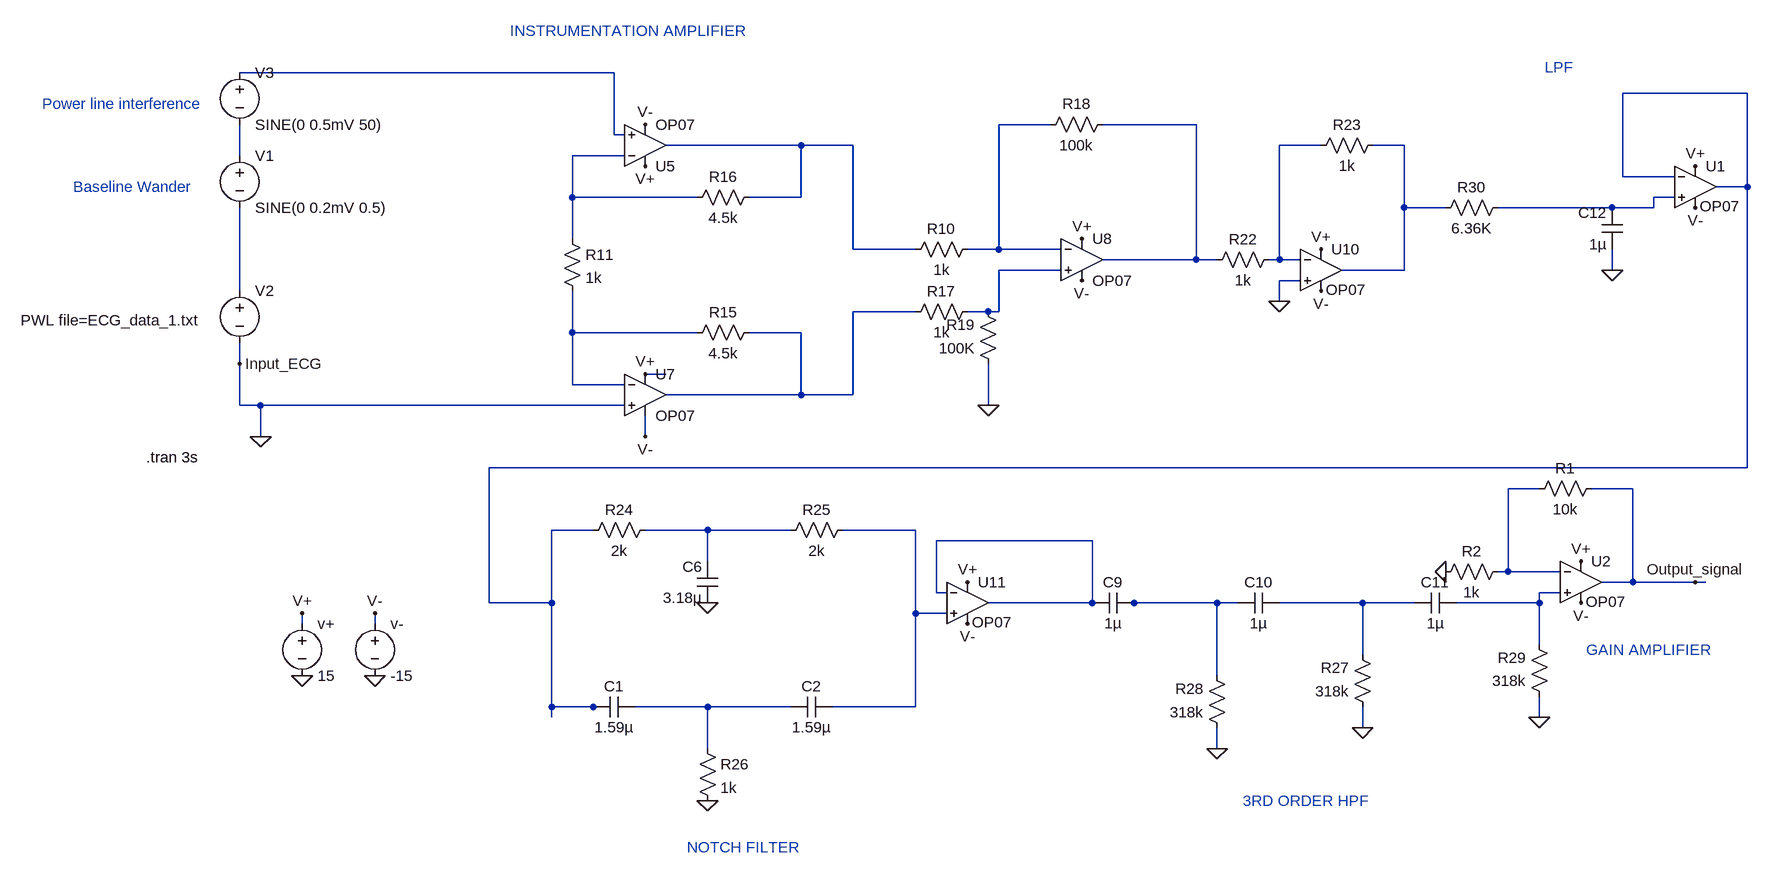
[diagram p0: schematic ECG_sim_Circuit.asc]
ECG_sim_Circuit.asc, the LTspice schematic file:
Version 4.1
SHEET 1 4292 2344
WIRE 336 736 -240 736
WIRE 2080 768 1888 768
WIRE 1008 816 928 816
WIRE 1232 816 1088 816
WIRE 336 832 336 736
WIRE 352 832 336 832
WIRE 624 848 416 848
WIRE 704 848 624 848
WIRE 1424 848 1360 848
WIRE 1552 848 1504 848
WIRE -240 864 -240 816
WIRE 352 864 272 864
WIRE 1888 896 1888 768
WIRE 1968 896 1888 896
WIRE 2080 912 2080 768
WIRE 2080 912 2032 912
WIRE 272 928 272 864
WIRE 464 928 272 928
WIRE 624 928 624 848
WIRE 624 928 544 928
WIRE 1968 928 1936 928
WIRE 1552 944 1552 848
WIRE 1616 944 1552 944
WIRE 1872 944 1696 944
WIRE 1936 944 1936 928
WIRE 1936 944 1872 944
WIRE 272 992 272 928
WIRE 704 1008 704 848
WIRE 800 1008 704 1008
WIRE 928 1008 928 816
WIRE 928 1008 880 1008
WIRE 1024 1008 928 1008
WIRE 1232 1024 1232 816
WIRE 1232 1024 1088 1024
WIRE 1264 1024 1232 1024
WIRE 1360 1024 1360 848
WIRE 1360 1024 1344 1024
WIRE 1392 1024 1360 1024
WIRE 1024 1040 928 1040
WIRE 1552 1040 1552 944
WIRE 1552 1040 1456 1040
WIRE 1872 1040 1872 1008
WIRE 1392 1056 1360 1056
WIRE -240 1072 -240 944
WIRE 1360 1088 1360 1056
WIRE 800 1104 704 1104
WIRE 912 1104 880 1104
WIRE 928 1104 928 1040
WIRE 928 1104 912 1104
WIRE 272 1136 272 1072
WIRE 464 1136 272 1136
WIRE 624 1136 544 1136
WIRE -240 1184 -240 1152
WIRE 416 1200 384 1200
WIRE 272 1216 272 1136
WIRE 352 1216 272 1216
WIRE 624 1232 624 1136
WIRE 624 1232 416 1232
WIRE 704 1232 704 1104
WIRE 704 1232 624 1232
WIRE -240 1248 -240 1184
WIRE -208 1248 -240 1248
WIRE 352 1248 -208 1248
WIRE 912 1248 912 1184
WIRE -208 1296 -208 1248
WIRE 384 1296 384 1264
WIRE 2080 1344 2080 912
WIRE 2080 1344 144 1344
WIRE 1760 1376 1712 1376
WIRE 1904 1376 1840 1376
WIRE 304 1440 240 1440
WIRE 480 1440 384 1440
WIRE 608 1440 480 1440
WIRE 800 1440 688 1440
WIRE 1072 1456 832 1456
WIRE 480 1488 480 1440
WIRE 1712 1504 1712 1376
WIRE 1712 1504 1696 1504
WIRE 1792 1504 1712 1504
WIRE 1904 1520 1904 1376
WIRE 1904 1520 1856 1520
WIRE 2000 1520 1904 1520
WIRE 2016 1520 2000 1520
WIRE 832 1536 832 1456
WIRE 848 1536 832 1536
WIRE 1792 1536 1760 1536
WIRE 144 1552 144 1344
WIRE 240 1552 240 1440
WIRE 240 1552 144 1552
WIRE 1072 1552 1072 1456
WIRE 1072 1552 912 1552
WIRE 1088 1552 1072 1552
WIRE 1136 1552 1120 1552
WIRE 1264 1552 1136 1552
WIRE 1296 1552 1264 1552
WIRE 1488 1552 1360 1552
WIRE 1568 1552 1488 1552
WIRE 1760 1552 1760 1536
WIRE 1760 1552 1632 1552
WIRE 800 1568 800 1440
WIRE 848 1568 800 1568
WIRE -144 1584 -144 1568
WIRE -32 1584 -32 1568
WIRE 1760 1616 1760 1552
WIRE 1488 1632 1488 1552
WIRE 1264 1664 1264 1552
WIRE 240 1712 240 1552
WIRE 304 1712 240 1712
WIRE 320 1712 304 1712
WIRE 480 1712 368 1712
WIRE 608 1712 480 1712
WIRE 800 1712 800 1568
WIRE 800 1712 672 1712
WIRE 240 1728 240 1712
WIRE 1760 1728 1760 1696
WIRE 1488 1744 1488 1712
WIRE 480 1776 480 1712
WIRE 1264 1776 1264 1744
FLAG -144 1664 0
FLAG -32 1664 0
FLAG -144 1568 V+
FLAG -32 1568 V-
FLAG 912 1248 0
FLAG -208 1296 0
FLAG 384 880 V+
FLAG 384 1200 V+
FLAG 384 1296 V-
FLAG 384 816 V-
FLAG 1056 1056 V-
FLAG 1056 992 V+
FLAG 1360 1088 0
FLAG 1424 1008 V+
FLAG 1424 1072 V-
FLAG 480 1552 0
FLAG 480 1856 0
FLAG 880 1520 V+
FLAG 880 1584 V-
FLAG 1264 1776 0
FLAG 1488 1744 0
FLAG 1760 1728 0
FLAG 1872 1040 0
FLAG 2000 880 V+
FLAG 2000 944 V-
FLAG 1824 1488 V+
FLAG 1824 1552 V-
FLAG 1616 1504 0
FLAG -240 1184 Input_ECG
FLAG 2000 1520 Output_signal
DATAFLAG -240 1024 ""
SYMBOL voltage -144 1568 R0
SYMATTR InstName v+
SYMATTR Value 15
SYMBOL voltage -32 1568 R0
WINDOW 123 0 0 Left 0
WINDOW 39 0 0 Left 0
SYMATTR InstName v-
SYMATTR Value -15
SYMBOL OpAmps\\OP07 384 912 M180
SYMATTR InstName U5
SYMBOL OpAmps\\OP07 384 1168 R0
SYMATTR InstName U7
SYMBOL OpAmps\\OP07 1056 960 R0
SYMATTR InstName U8
SYMBOL res 896 992 R90
WINDOW 0 0 56 VBottom 2
WINDOW 3 32 56 VTop 2
SYMATTR InstName R10
SYMATTR Value 1k
SYMBOL res 256 976 R0
SYMATTR InstName R11
SYMATTR Value 1k
SYMBOL res 560 1120 R90
WINDOW 0 0 56 VBottom 2
WINDOW 3 32 56 VTop 2
SYMATTR InstName R15
SYMATTR Value 4.5k
SYMBOL res 560 912 R90
WINDOW 0 0 56 VBottom 2
WINDOW 3 32 56 VTop 2
SYMATTR InstName R16
SYMATTR Value 4.5k
SYMBOL res 896 1088 R90
WINDOW 0 0 56 VBottom 2
WINDOW 3 32 56 VTop 2
SYMATTR InstName R17
SYMATTR Value 1k
SYMBOL res 1104 800 R90
WINDOW 0 0 56 VBottom 2
WINDOW 3 32 56 VTop 2
SYMATTR InstName R18
SYMATTR Value 100k
SYMBOL res 928 1200 R180
WINDOW 0 36 76 Left 2
WINDOW 3 36 40 Left 2
SYMATTR InstName R19
SYMATTR Value 100K
SYMBOL voltage -240 1056 R0
WINDOW 3 -337 61 Left 2
WINDOW 123 0 0 Left 0
WINDOW 39 0 0 Left 0
SYMATTR Value PWL file=ECG_data_1.txt
SYMATTR InstName V2
SYMBOL OpAmps\\OP07 1424 976 R0
WINDOW 3 7 94 Left 2
SYMATTR InstName U10
SYMBOL res 1360 1008 R90
WINDOW 0 0 56 VBottom 2
WINDOW 3 32 56 VTop 2
SYMATTR InstName R22
SYMATTR Value 1k
SYMBOL res 1520 832 R90
WINDOW 0 0 56 VBottom 2
WINDOW 3 32 56 VTop 2
SYMATTR InstName R23
SYMATTR Value 1k
SYMBOL cap 368 1696 R90
WINDOW 0 0 32 VBottom 2
WINDOW 3 32 32 VTop 2
SYMATTR InstName C1
SYMATTR Value 1.59µ
SYMBOL cap 672 1696 R90
WINDOW 0 0 32 VBottom 2
WINDOW 3 32 32 VTop 2
SYMATTR InstName C2
SYMATTR Value 1.59µ
SYMBOL cap 496 1552 R180
WINDOW 0 24 56 Left 2
WINDOW 3 24 8 Left 2
SYMATTR InstName C6
SYMATTR Value 3.18µ
SYMBOL res 400 1424 R90
WINDOW 0 0 56 VBottom 2
WINDOW 3 32 56 VTop 2
SYMATTR InstName R24
SYMATTR Value 2k
SYMBOL res 704 1424 R90
WINDOW 0 0 56 VBottom 2
WINDOW 3 32 56 VTop 2
SYMATTR InstName R25
SYMATTR Value 2k
SYMBOL OpAmps\\OP07 880 1488 R0
WINDOW 3 7 94 Left 2
SYMATTR InstName U11
SYMBOL res 464 1760 R0
SYMATTR InstName R26
SYMATTR Value 1k
SYMBOL cap 1136 1536 R90
WINDOW 0 0 32 VBottom 2
WINDOW 3 32 32 VTop 2
SYMATTR InstName C9
SYMATTR Value 1µ
SYMBOL res 1280 1760 R180
WINDOW 0 36 76 Left 2
WINDOW 3 36 40 Left 2
SYMATTR InstName R28
SYMATTR Value 318k
SYMBOL res 1504 1728 R180
WINDOW 0 36 76 Left 2
WINDOW 3 36 40 Left 2
SYMATTR InstName R27
SYMATTR Value 318k
SYMBOL cap 1360 1536 R90
WINDOW 0 0 32 VBottom 2
WINDOW 3 32 32 VTop 2
SYMATTR InstName C10
SYMATTR Value 1µ
SYMBOL res 1776 1712 R180
WINDOW 0 36 76 Left 2
WINDOW 3 36 40 Left 2
SYMATTR InstName R29
SYMATTR Value 318k
SYMBOL cap 1632 1536 R90
WINDOW 0 0 32 VBottom 2
WINDOW 3 32 32 VTop 2
SYMATTR InstName C11
SYMATTR Value 1µ
SYMBOL res 1712 928 R90
WINDOW 0 0 56 VBottom 2
WINDOW 3 32 56 VTop 2
SYMATTR InstName R30
SYMATTR Value 6.36K
SYMBOL cap 1888 1008 R180
WINDOW 0 24 56 Left 2
WINDOW 3 24 8 Left 2
SYMATTR InstName C12
SYMATTR Value 1µ
SYMBOL OpAmps\\OP07 2000 848 R0
WINDOW 3 7 94 Left 2
SYMATTR InstName U1
SYMBOL OpAmps\\OP07 1824 1456 R0
WINDOW 3 7 94 Left 2
SYMATTR InstName U2
SYMBOL res 1856 1360 R90
WINDOW 0 0 56 VBottom 2
WINDOW 3 32 56 VTop 2
SYMATTR InstName R1
SYMATTR Value 10k
SYMBOL res 1712 1488 R90
WINDOW 0 0 56 VBottom 2
WINDOW 3 32 56 VTop 2
SYMATTR InstName R2
SYMATTR Value 1k
SYMBOL voltage -240 848 R0
WINDOW 123 0 0 Left 0
WINDOW 39 0 0 Left 0
SYMATTR InstName V1
SYMATTR Value SINE(0 0.2mV 0.5)
SYMBOL voltage -240 720 R0
WINDOW 123 0 0 Left 0
WINDOW 39 0 0 Left 0
SYMATTR InstName V3
SYMATTR Value SINE(0 0.5mV 50)
TEXT -384 1328 Left 2 !.tran 3s
TEXT -544 784 Left 2 ;Power line interference
TEXT -496 912 Left 2 ;Baseline Wander
TEXT 176 672 Left 2 ;INSTRUMENTATION AMPLIFIER
TEXT 1768 728 Left 2 ;LPF
TEXT 1304 1856 Left 2 ;3RD ORDER HPF
TEXT 448 1928 Left 2 ;NOTCH FILTER
TEXT 1832 1624 Left 2 ;GAIN AMPLIFIER

The netlist it stands for:
* ECG_sim_Circuit.asc
v+ V+ 0 15
v- V- 0 -15
X§U5 N001 N009 V+ V- N005 LT1001  ; OP07, pins In+ In- V+ V- OUT
X§U7 0 N014 V+ V- N013 LT1001  ; OP07, pins In+ In- V+ V- OUT
X§U8 N011 N003 V+ V- N004 LT1001  ; OP07, pins In+ In- V+ V- OUT
R10 N003 N005 1k
R11 N009 N014 1k
R15 N013 N014 4.5k
R16 N005 N009 4.5k
R17 N011 N013 1k
R18 N004 N003 100k
R19 0 N011 100K
V2 N012 0 PWL file=ECG_data_1.txt
X§U10 0 N006 V+ V- N007 LT1001  ; OP07, pins In+ In- V+ V- OUT
R22 N006 N004 1k
R23 N007 N006 1k
C1 N022 N002 1.59µ
C2 N017 N022 1.59µ
C6 0 N016 3.18µ
R24 N016 N002 2k
R25 N017 N016 2k
X§U11 N017 N018 V+ V- N018 LT1001  ; OP07, pins In+ In- V+ V- OUT
R26 N022 0 1k
C9 N020 N018 1µ
R28 0 N020 318k
R27 0 N021 318k
C10 N021 N020 1µ
R29 0 N019 318k
C11 N019 N021 1µ
R30 N010 N007 6.36K
C12 0 N010 1µ
X§U1 N010 N002 V+ V- N002 LT1001  ; OP07, pins In+ In- V+ V- OUT
X§U2 N019 N015 V+ V- Output_signal LT1001  ; OP07, pins In+ In- V+ V- OUT
R1 Output_signal N015 10k
R2 N015 0 1k
V1 N008 N012 SINE(0 0.2mV 0.5)
V3 N001 N008 SINE(0 0.5mV 50)
.tran 3s
* Power line interference
* Baseline Wander
* INSTRUMENTATION AMPLIFIER
* LPF
* 3RD ORDER HPF
* NOTCH FILTER
* GAIN AMPLIFIER
.lib LTC.lib
.backanno
.end